# EAGLE design powerOutageLogger (EAGLE 9.6.2)
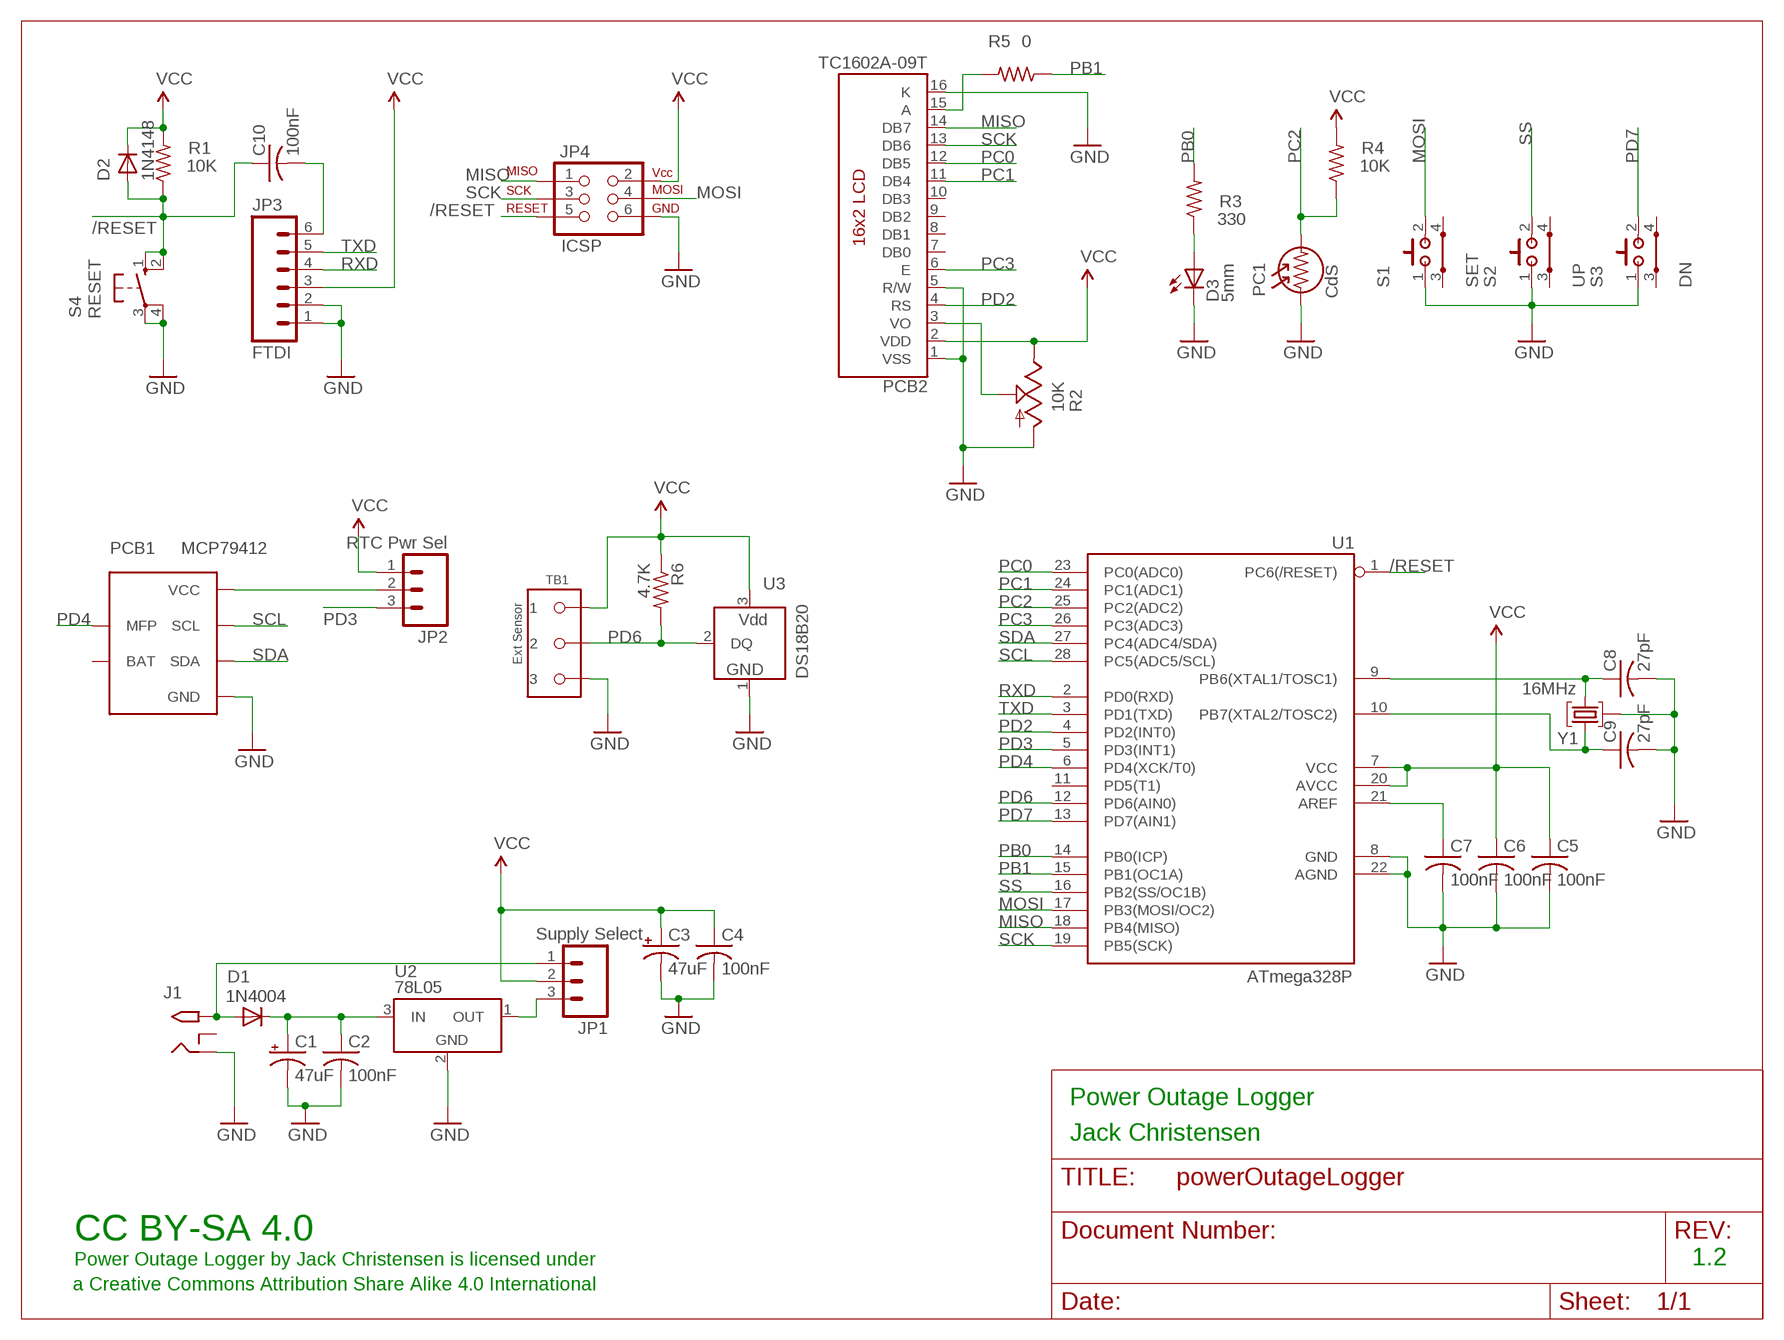
[diagram p0: schematic, sheet 1]

## Parts
C1  47uF  CPOL-USE2-5  [E2-5]
C2  100nF  C-US025-025X050  [C025-025X050]
C3  47uF  CPOL-USE2-5  [E2-5]
C4  100nF  C-US025-025X050  [C025-025X050]
C5  100nF  C-US025-025X050  [C025-025X050]
C6  100nF  C-US025-025X050  [C025-025X050]
C7  100nF  C-US025-025X050  [C025-025X050]
C8  27pF  C-US025-025X050  [C025-025X050]
C9  27pF  C-US025-025X050  [C025-025X050]
C10  100nF  C-US025-025X050  [C025-025X050]
D1  1N4004  DIODE1N400X  [1N400X]
D2  1N4148  DIODE1N4148  [1N4148]
D3  5mm  LED5MM  [LED5MM]
J1  2.1MMJACKTHM  [PJ-102A]
JP1  Supply Select  M03LOCK  [1X03_LOCK]
JP2  RTC Pwr Sel  M03LOCK  [1X03_LOCK]
JP3  FTDI  M06LOCK  [1X06_LOCK]
JP4  ICSP  AVR_SPI_PRG_6PTH  [2X3]
PC1  CdS  PHOTOCELL020-017  [PHOTOCELL-020-017]
PCB1  MCP79412  RTC79412  [RTC79412]
PCB2  TC1602A-09T  LCD-16X2  [LCD-16X2]
R1  10K  R-US_0204/6  [0204/6]
R2  10K  TRIMPOT-3386P3386P  [TRIMPOT-3386P]
R3  330  R-US_0204/6  [0204/6]
R4  10K  R-US_0204/6  [0204/6]
R5  0  R-US_0204/6  [0204/6]
R6  4.7K  R-US_0204/6  [0204/6]
S1  SET  B3F-312X  [B3F-312X]
S2  UP  B3F-312X  [B3F-312X]
S3  DN  B3F-312X  [B3F-312X]
S4  RESET  10-XXOCT  [B3F-10XXOCT]
TB1  Ext Sensor  OST-TB-33.5MM  [OST-TB-3-3.5MM]
U1  ATmega328P  AVR-MEGA8-PPTH  [DIL28-3]
U2  78L05  78XX-HTO92  [TO92-INLINE]
U3  DS18B20  [TO92-OVAL]
Y1  16MHz  RESONATOR  [RESONATOR]

## Nets
/RESET: C10.1 D2.A JP4.5 R1.1 S4.1(S) S4.2(S1) U1.1(PC6(/RESET))
GND: C1.- C2.2 C3.- C4.2 C5.2 C6.2 C7.2 C8.2 C9.2 D3.K(C) J1.RING JP3.1 JP3.2 JP4.6 PC1.P$1 PCB1.8(GND) PCB2.1(VSS) PCB2.5(R/W) PCB2.16(K) R2.3(A) S1.1 S2.1 S3.1 S4.3(P) S4.4(P1) TB1.P$3 U1.8(GND) U1.22(AGND) U2.2(GND) U3.1(GND) Y1.2
MISO: JP4.1 PCB2.14(DB7) U1.18(PB4(MISO))
MOSI: JP4.4 S1.2 U1.17(PB3(MOSI/OC2))
N$1: D1.A J1.TIP JP1.1
N$2: C1.+ C2.1 D1.K U2.3(IN)
N$3: PCB2.3(VO) R2.2(S)
N$4: D3.A R3.1
N$5: JP2.2 PCB1.7(VCC)
N$6: PCB2.15(A) R5.2
N$9: C7.1 U1.21(AREF)
OUT: JP1.3 U2.1(OUT)
PB0: R3.2 U1.14(PB0(ICP))
PB1: R5.1 U1.15(PB1(OC1A))
PC0: PCB2.12(DB5) U1.23(PC0(ADC0))
PC1: PCB2.11(DB4) U1.24(PC1(ADC1))
PC2: PC1.P$2 R4.1 U1.25(PC2(ADC2))
PC3: PCB2.6(E) U1.26(PC3(ADC3))
PD2: PCB2.4(RS) U1.4(PD2(INT0))
PD3: JP2.3 U1.5(PD3(INT1))
PD4: PCB1.3(MFP) U1.6(PD4(XCK/T0))
PD6: R6.2 TB1.P$2 U1.12(PD6(AIN0)) U3.2(DQ)
PD7: S3.2 U1.13(PD7(AIN1))
RST: C10.2 JP3.6
RXD: JP3.4 U1.2(PD0(RXD))
SCK: JP4.3 PCB2.13(DB6) U1.19(PB5(SCK))
SCL: PCB1.6(SCL) U1.28(PC5(ADC5/SCL))
SDA: PCB1.5(SDA) U1.27(PC4(ADC4/SDA))
SS: S2.2 U1.16(PB2(SS/OC1B))
TXD: JP3.5 U1.3(PD1(TXD))
VCC: C3.+ C4.1 C5.1 C6.1 D2.K JP1.2 JP2.1 JP3.3 JP4.2 PCB2.2(VDD) R1.2 R2.1(E) R4.2 R6.1 TB1.P$1 U1.7(VCC) U1.20(AVCC) U3.3(VDD)
XTAL1: C9.1 U1.10(PB7(XTAL2/TOSC2)) Y1.1
XTAL2: C8.1 U1.9(PB6(XTAL1/TOSC1)) Y1.3
Unconnected: J1.RING_SW PCB1.1(BAT) PCB2.7(DB0) PCB2.8(DB1) PCB2.9(DB2) PCB2.10(DB3) S1.3 S1.4 S2.3 S2.4 S3.3 S3.4 U1.11(PD5(T1))

## Notes on the sheet
- Power Outage Logger
- Jack Christensen
- CC BY-SA 4.0
- Power Outage Logger by Jack Christensen is licensed under | 1.2
- a Creative Commons Attribution Share Alike 4.0 International

## Library data of the parts
C1 C3 = _jc:CPOL-US: POLARIZED CAPACITOR, American symbol
C2 C4-C10 = _jc:C-US: CAPACITOR, American symbol
D1 D2 = _jc:DIODE
D3 = _jc:LED: LED OSRAM: - CHIPLED LG R971, LG N971, LY N971, LG Q971, LY Q971, LO R971, LY R971 LH N974, LH R974 LS Q976, LO Q976, LY Q976 LO Q996 - Hyper CHIPLED LW Q18S LB Q993, LB Q99A, LB R99A - SideLED LS A670, LO A670, LY A670, LG A670, LP A670 LB A673, LV A673, LT A673, LW A673 LH A674 LY A675 LS A676, LA A676, LO A676, LY A676, LW A676 LS A679, LY A679, LG A679 - Hyper Micro SIDELED® LS Y876, LA Y876, LO Y876, LY Y876 LT Y87S - SmartLED LW L88C, LW L88S LB L89C, LB L89S, LG L890 LS L89K, LO L89K, LY L89K LS L896, LA L896, LO L896, LY L896 - TOPLED LS T670, LO T670, LY T670, LG T670, LP T670 LSG T670, LSP T670, LSY T670, LOP T670, LYG T670 LG T671, LOG T671, LSG T671 LB T673, LV T673, LT T673, LW T673 LH T674 LS T676, LA T676, LO T676, LY T676, LB T676, LH T676, LSB T676, LW T676 LB T67C, LV T67C, LT T67C, LS T67K, LO T67K, LY T67K, LW E67C LS E67B, LA E67B, LO E67B, LY E67B, LB E67C, LV E67C, LT E67C LW T67C LS T679, LY T679, LG T679 LS T770, LO T770, LY T770, LG T770, LP T770 LB T773, LV T773, LT T773, LW T773 LH T774 LS E675, LA E675, LY E675, LS T675 LS T776, LA T776, LO T776, LY T776, LB T776 LHGB T686 LT T68C, LB T68C - Hyper Mini TOPLED® LB M676 - Mini TOPLED Santana® LG M470 LS M47K, LO M47K, LY M47K Source: http://www.osram.convergy.de/
J1 = adafruit:2.1MMJACK: 2.1mm x 5.5mm THM DC jack with internal switch. Digikey part #PJ-102A, 4UCON part #05537 2.1mm x 5.5mm SMT DC jack with internal switch. Digikey part #PJ-002A-SMT, 4UCON part #03267 By microbuilder.eu & adafruit.com
JP1 JP2 = SparkFun:M03: Header 3 Standard 3-pin 0.1" header. Use with straight break away headers (SKU : PRT-00116), right angle break away headers (PRT-00553), swiss pins (PRT-00743), machine pins (PRT-00117), and female headers (PRT-00115). Molex polarized connector foot print use with SKU : PRT-08232 with associated crimp pins and housings.
JP3 = SparkFun:M06: Header 6 Standard 6-pin 0.1" header. Use with straight break away headers (SKU : PRT-00116), right angle break away headers (PRT-00553), swiss pins (PRT-00743), machine pins (PRT-00117), and female headers (PRT-00115). Molex polarized connector foot print use with SKU : PRT-08094 with associated crimp pins and housings. NOTES ON THE VARIANTS LOCK and LOCK_LONGPADS... This footprint was designed to help hold the alignment of a through-hole component (i.e. 6-pin header) while soldering it into place. You may notice that each hole has been shifted either up or down by 0.005 of an inch from it's more standard position (which is a perfectly straight line). This slight alteration caused the pins (the squares in the middle) to touch the edges of the holes. Because they are alternating, it causes a "brace" to hold the component in place. 0.005 has proven to be the perfect amount of "off-center" position when using our standard breakaway headers. Although looks a little odd when you look at the bare footprint, once you have a header in there, the alteration is very hard to notice. Also, if you push a header all the way into place, it is covered up entirely on the bottom side. This idea of altering the position of holes to aid alignment will be further integrated into the Sparkfun Library for other footprints. It can help hold any component with 3 or more connection pins.
JP4 = _jc:AVR_SPI_PRG_6: AVR ISP 6 Pin This is the reduced ISP connector for AVR programming. Common on Arduino. This footprint will take up less PCB space and can be used with a 10-pin to 6-pin adapter such as SKU: BOB-08508
PC1 = _jc:PHOTOCELL
PCB1 = _jc:RTC79412
PCB2 = SparkFun:LCD-16X2
R1 R3-R6 = _jc:R-US_: RESISTOR, American symbol
R2 = _jc:TRIMPOT-3386P
S1-S3 = _jc:B3F-312X
S4 = _jc:10-XX: OMRON SWITCH
TB1 = _jc:OST-TB-3
U1 = SparkFun:AVR-MEGA8-P: MICROCONTROLLER 8 Kbytes FLASH 1 kbytes SRAM 512 bytes EEPROM USART 4-channel 10 bit ADC 2-channel 8 bit ADC
U2 = _jc:78XX-H
U3 = _jc:DS18B20
Y1 = _jc:RESONATOR: Ceramic resonator with capacitors or HC49/US crystal

## Board
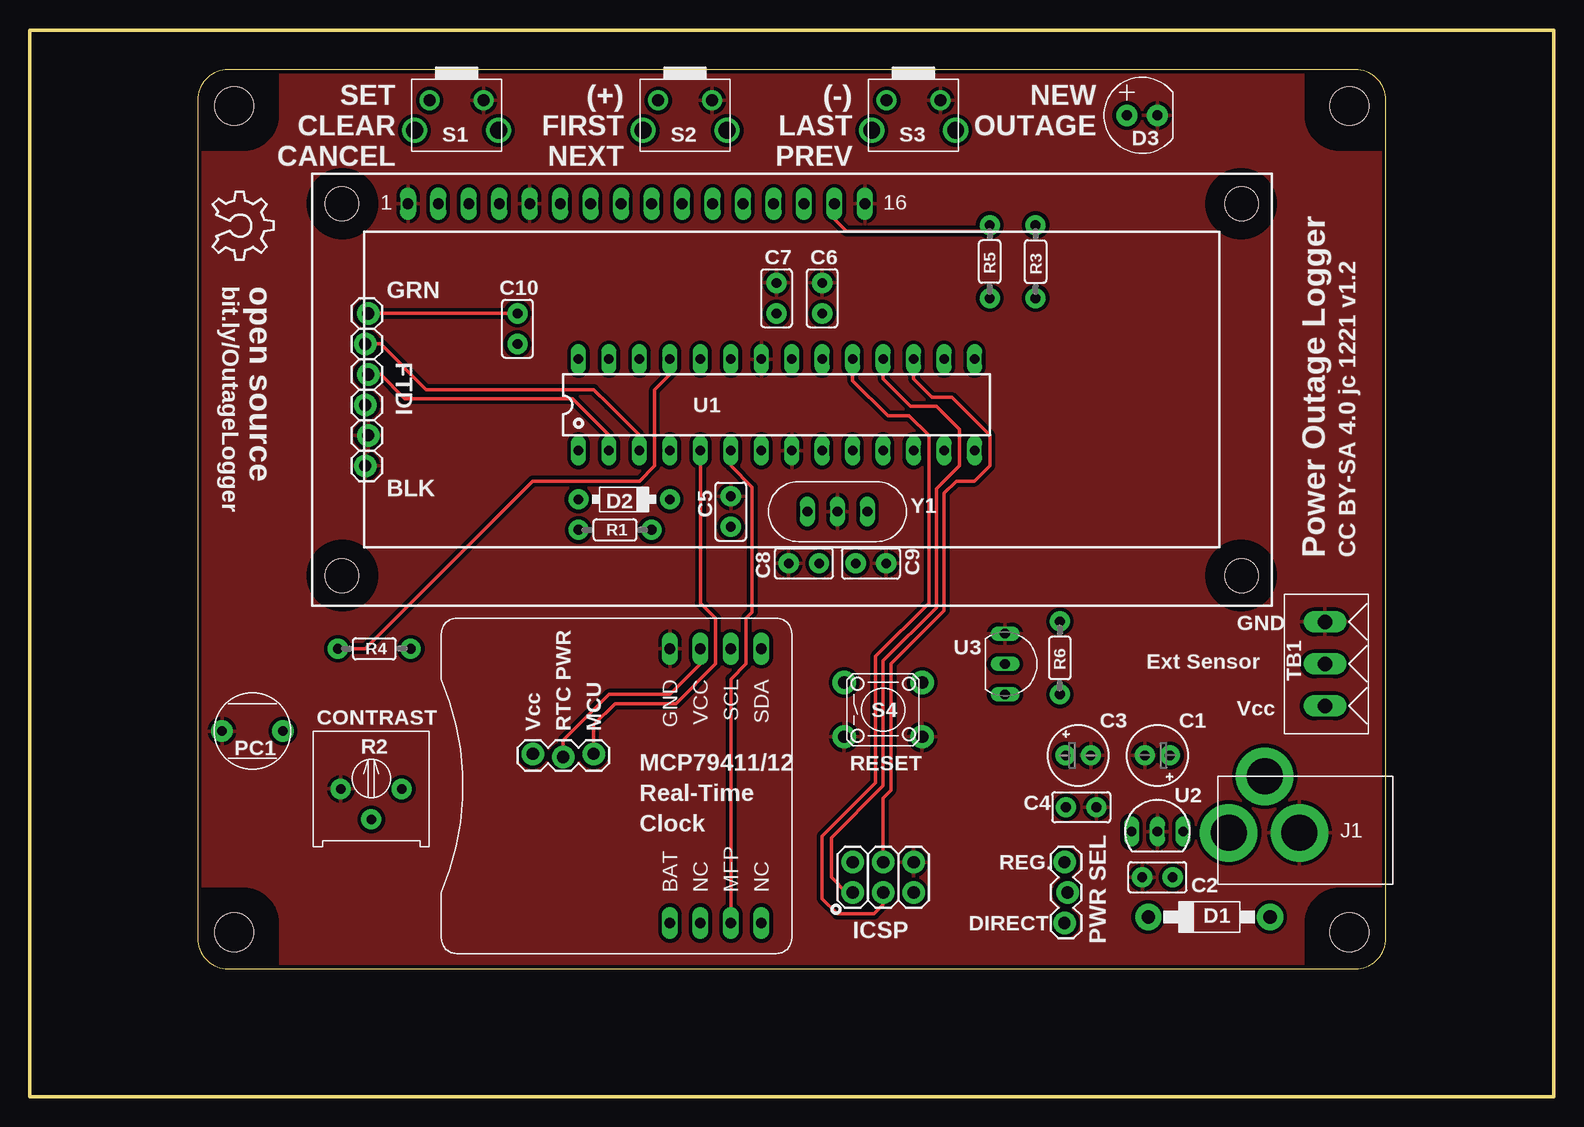
[diagram p1: board, top side]
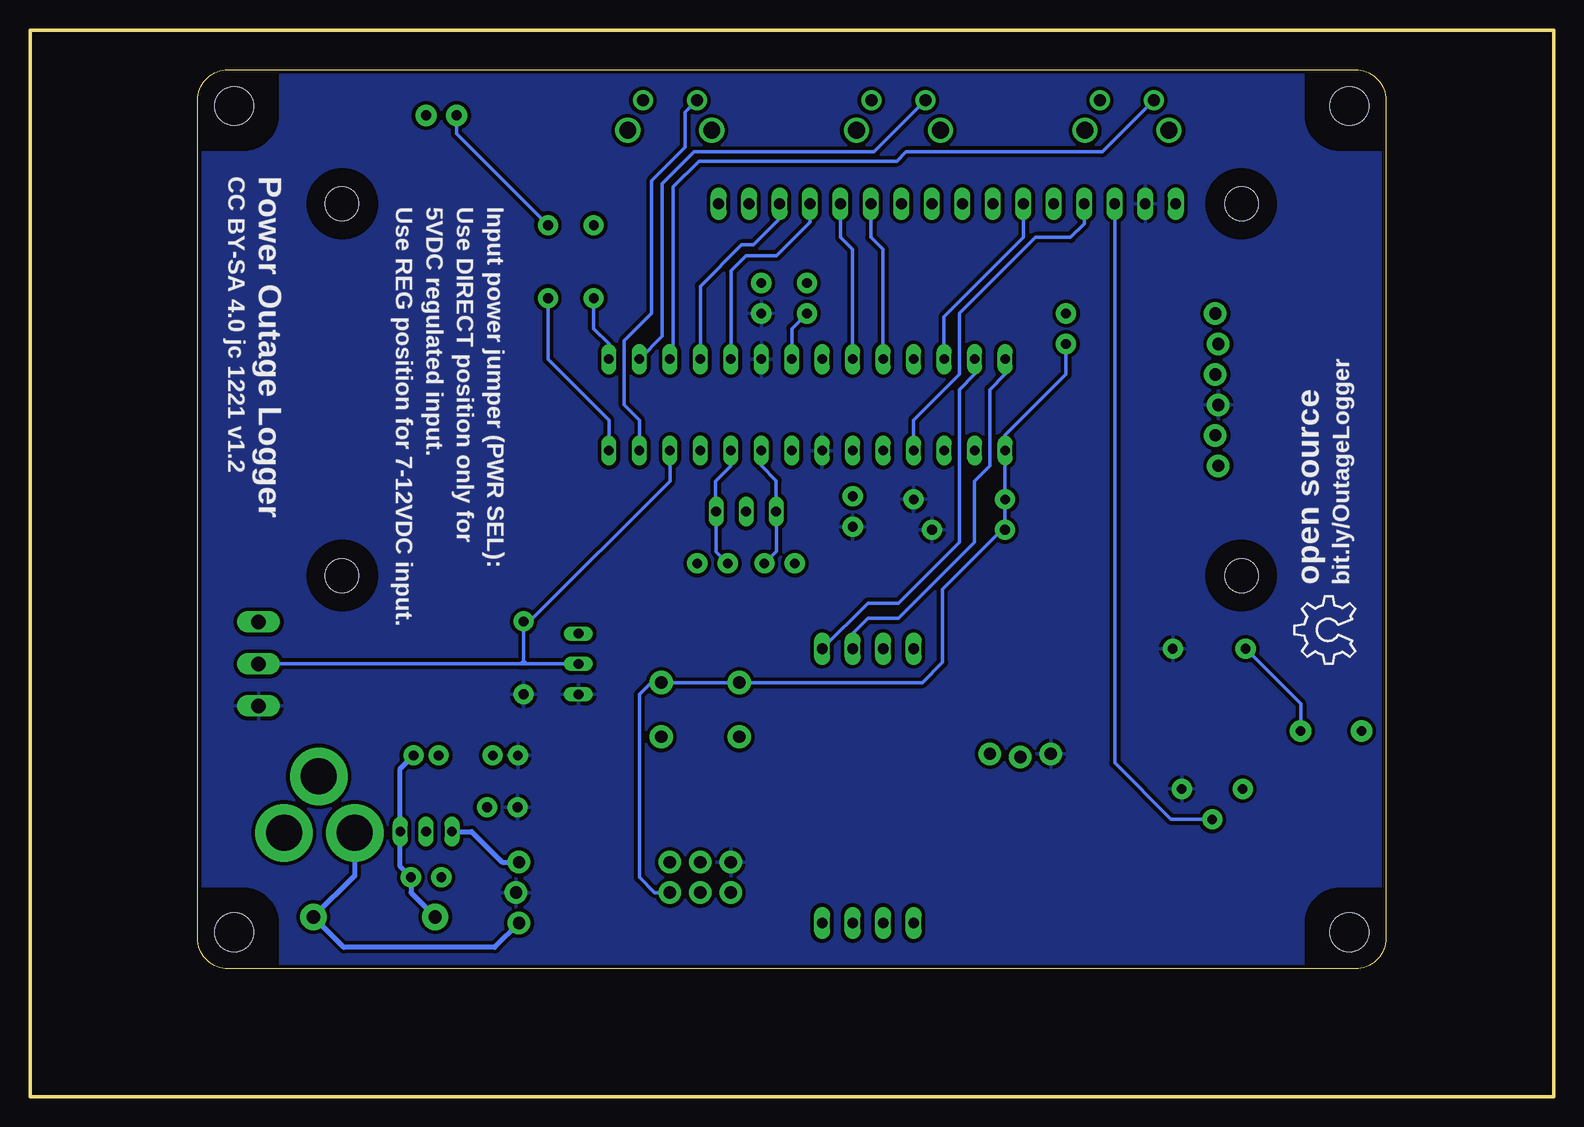
[diagram p2: board, bottom side, seen from below]

Size 127 x 88.9 mm. Coordinates in mm from the lower left corner, seen from the top.
Outline: 13.97,83.06 13.97,13.21 arc90 16.51,10.67 110.49,10.67 arc90 113.03,13.21 113.03,83.06 arc90 110.49,85.6 16.51,85.6 arc90 13.97,83.06
Outline: 0,88.9 127,88.9 127,0 0,0 0,88.9
Copper layers (1*16): Top 0.0356mm / dielectric 1.5011mm / Bottom 0.0356mm
Design rules "oshpark-2layer-jc": minimum track width 8mil, minimum drill 13mil, track to track 8mil, track to pad 8mil, pad to pad 8mil, via to via 8mil, smd to smd 6mil, copper to edge 12mil, drill to drill 6mil, minimum pad ring 7mil, minimum via ring 7mil, stop-mask expansion 2.5mil, vias tented up to drill 20mil, thermal gap 12mil
Holes 3.2 mm at 17.02,82.55 109.98,82.55 109.98,13.72 17.02,13.72
tRestrict: area 14,79.2 to 20.3,85.6; area 106.7,79.2 to 113,85.6; area 106.7,10.7 to 113,17; area 14,10.7 to 20.3,17; area 24,72.4 to 28.1,76.5; area 24,41.4 to 28.1,45.5; area 98.9,72.4 to 103,76.5; area 98.9,41.4 to 103,45.5
bRestrict: area 106.7,79.2 to 113,85.6; area 106.7,10.7 to 113,17; area 14,79.2 to 20.3,85.6; area 14,10.7 to 20.3,17; area 98.9,41.4 to 103,45.5; area 98.9,72.4 to 103,76.5; area 24,41.4 to 28.1,45.5; area 24,72.4 to 28.1,76.5

### Footprints (pad centres in the part's own frame; a part is rotated, then mirrored left to right if it is on the bottom)
E2-5 = drill 0.813 pad 1.676: + -1.05,0; - 1.05,0
C025-025X050 = drill 0.813 pad 1.676: 1 -1.27,0; 2 1.27,0
1N400X = drill 1.1 pad 2.184: A 5.08,0; K -5.08,0
1N4148 = drill 0.8 pad 1.676: A 3.81,0; K -3.81,0
LED5MM = drill 0.813 pad 1.778: A -1.27,0; K 1.27,0
PJ-102A = drill 3 pad 4.8: RING 0.1,-3.39; RING_SW -4.6,-6.29; TIP 0.1,-9.29
1X03_LOCK = drill 1.016 pad 1.88: 1 0,0.127; 2 2.54,-0.127; 3 5.08,0.127
1X06_LOCK = drill 1.016 pad 1.88: 1 0,0; 2 2.54,-0.254; 3 5.08,0; 4 7.62,-0.254; 5 10.16,0; 6 12.7,-0.254
2X3 = drill 1.016 pad 1.88: 1 0,0; 2 0,2.54; 3 2.54,0; 4 2.54,2.54; 5 5.08,0; 6 5.08,2.54
PHOTOCELL-020-017 = drill 0.8 pad 1.778: P$1 -2.54,0; P$2 2.54,0
RTC79412 = drill 0.9 long: 1 -11.43,-3.81; 2 -11.43,-6.35; 3 -11.43,-8.89; 4 -11.43,-11.43; 5 11.43,-11.43; 6 11.43,-8.89; 7 11.43,-6.35; 8 11.43,-3.81
LCD-16X2 = drill 0.9 long: 1 -32,15.5; 2 -29.46,15.5; 3 -26.92,15.5; 4 -24.38,15.5; 5 -21.84,15.5; 6 -19.3,15.5; 7 -16.76,15.5; 8 -14.22,15.5; 9 -11.68,15.5; 10 -9.14,15.5; 11 -6.6,15.5; 12 -4.06,15.5; 13 -1.52,15.5; 14 1.02,15.5; 15 3.56,15.5; 16 6.1,15.5 | hole 2.8: -37.5,15.5; -37.5,-15.5; 37.5,15.5; 37.5,-15.5
0204/6 = drill 0.813 pad 1.676: 1 -3.04,0; 2 3.04,0
TRIMPOT-3386P = drill 0.8 pad 1.676: 1 2.54,0; 2 0,-2.54; 3 -2.54,0
B3F-312X = drill 1 pad 1.676: 1 2.25,1.25; 2 -2.25,1.25 | drill 1.4: 3 3.5,-1.25; 4 -3.5,-1.25
B3F-10XXOCT = drill 1.016 pad 1.93: 1 -3.251,2.261; 2 3.251,2.261; 3 -3.251,-2.261; 4 3.251,-2.261
OST-TB-3-3.5MM = drill 1.2 long: P$1 -3.5,0; P$2 0,0; P$3 3.5,0
DIL28-3 = drill 0.8 pad 1.27 long: 1 -16.51,-3.81; 2 -13.97,-3.81; 3 -11.43,-3.81; 4 -8.89,-3.81; 5 -6.35,-3.81; 6 -3.81,-3.81; 7 -1.27,-3.81; 8 1.27,-3.81; 9 3.81,-3.81; 10 6.35,-3.81; 11 8.89,-3.81; 12 11.43,-3.81; 13 13.97,-3.81; 14 16.51,-3.81; 15 16.51,3.81; 16 13.97,3.81; 17 11.43,3.81; 18 8.89,3.81; 19 6.35,3.81; 20 3.81,3.81; 21 1.27,3.81; 22 -1.27,3.81; 23 -3.81,3.81; 24 -6.35,3.81; 25 -8.89,3.81; 26 -11.43,3.81; 27 -13.97,3.81; 28 -16.51,3.81
TO92-INLINE = drill 0.8 pad 1.27 long: 1 -2.159,0; 2 0,0; 3 2.159,0
TO92-OVAL = drill 0.813 long: 1 -2.54,0; 2 0,0; 3 2.54,0
RESONATOR = drill 0.8 pad 1.27 long: 1 -2.5,0; 2 0,0; 3 2.5,0

### Placement (x,y rotation side)
C1  93.98,28.45 180 top
C2  93.98,18.29 180 top
C3  87.38,28.45 0 top
C4  87.63,24.13 0 top
C5  58.42,48.77 90 top
C6  66.04,66.55 90 top
C7  62.23,66.55 90 top
C8  64.52,44.45 180 top
C9  70.1,44.45 0 top
C10  40.64,64.01 90 top
D1  98.3,14.99 0 top
D2  49.53,49.78 180 top
D3  92.71,81.79 0 top
J1  109.22,22.1 270 top
JP1  86.36,14.48 90 top
JP2  41.91,28.45 0 top
JP3  27.94,52.58 90 top
JP4  68.58,17.02 0 top
PC1  18.54,30.48 0 top
PCB1  49.53,25.91 90 top
PCB2  63.5,58.93 0 top
R1  48.77,47.24 0 top
R2  28.45,25.65 0 top
R3  83.82,69.6 270 top
R4  28.7,37.34 0 top
R5  80.01,69.6 90 top
R6  85.85,36.58 90 top
S1  35.56,81.79 0 top
S2  54.61,81.79 0 top
S3  73.66,81.79 0 top
S4  71.12,32.26 0 top
TB1  107.95,36.07 90 top
U1  62.23,57.66 0 top
U2  93.98,22.1 0 top
U3  81.28,36.07 270 top
U$1  [OSHW_8X200_NOTEXT]  15.24,75.44 270 top
U$2  [OSHW_8X200_NOTEXT]  16.51,36.07 90 bottom
Y1  67.31,48.77 180 top

### Tracks (layer width: path | path; a pad name or v marks a point on that pad's centre or on a via)
/RESET
  Bottom 0.305: JP4.5 74.93,17.02 76.2,18.29 76.2,33.53 75.21,34.52 S4.2 S4.1 52.6,34.52 50.93,36.2 50.93,42.29 45.97,47.25 R1.1 | C10.1 40.64,60.2 45.72,55.12 U1.1 D2.A R1.1 | R1.1
GND
  pour Top (isolate 0.305): 11.43,88.14 115.57,88.14 115.57,8.13 11.43,8.13
MISO
  Top 0.305: U1.18 71.12,59.82 73.41,57.53 75.56,57.53 77.47,55.63 77.47,52.58 75.56,50.67 75.56,40.77 71.12,36.32 71.12,25.91 66.8,21.59 66.8,18.29 68.07,17.02 JP4.1
  Bottom 0.305: PCB2.14 64.52,73.15 66.67,70.99 67.69,70.99 71.12,67.56 U1.18
MOSI
  Top 0.305: U1.17 73.66,59.82 75.18,58.29 76.84,58.29 80.01,55.12 80.01,52.58 78.74,51.31 77.22,51.31 76.2,50.29 76.2,40.51 71.75,36.07 71.75,25.53 71.12,24.89 JP4.4
  Bottom 0.305: U1.17 73.41,61.72 73.41,75.82 71.25,77.98 54.74,77.98 53.98,78.74 37.61,78.74 S1.2
N$1
  Bottom 0.406: J1.TIP 99.93,18.43 D1.A 100.84,12.45 88.27,12.45 JP1.1
N$2
  Bottom 0.406: C1.+ 96.14,27.34 U2.3 96.14,19.18 C2.1 95.25,17.02 D1.K
N$3
  Bottom 0.305: R2.2 31.88,23.11 36.58,27.82 PCB2.3
N$4
  Bottom 0.305: R3.1 91.44,80.26 D3.A
N$5
  Top 0.305: PCB1.7 55.88,36.07 53.34,33.53 48.26,33.53 44.45,29.72 JP2.2
N$6
  Top 0.305: R5.2 79.51,72.14 68.07,72.14 67.06,73.15 PCB2.15
N$9
  Bottom 0.305: C7.1 63.5,64.01 U1.21
OUT
  Bottom 0.406: U2.1 90.17,22.1 87.63,19.56 JP1.3
PB0
  Bottom 0.305: U1.14 78.74,56.39 83.82,61.47 R3.2
PB1
  Bottom 0.305: U1.15 78.74,62.74 80.01,64.01 R5.1
PC0
  Bottom 0.305: PCB2.12 59.44,71.63 58.42,70.61 58.42,70.36 U1.23
PC1
  Bottom 0.305: PCB2.11 56.9,71.63 55.88,70.61 U1.24
PC2
  Top 0.305: R4.1 27.94,37.34 41.91,51.31 50.8,51.31 52.07,52.58 52.07,58.93 53.34,60.2 U1.25
  Bottom 0.305: R4.1 21.08,32.76 PC1.P$2
PC3
  Bottom 0.305: PCB2.6 44.2,71.63 50.8,65.02 U1.26
PD2
  Bottom 0.305: U1.4 53.34,56.39 49.53,60.2 49.53,65.28 43.18,71.63 40.26,71.63 39.12,72.77 PCB2.4
PD3
  Top 0.305: JP2.3 46.99,30.99 48.77,32.77 53.85,32.77 57.15,36.07 57.15,39.88 55.88,41.15 U1.5
PD4
  Top 0.305: U1.6 58.42,52.58 60.2,50.8 60.2,40.39 59.69,39.88 59.69,36.07 58.42,34.8 PCB1.3
PD6
  Bottom 0.305: U3.2 85.6,36.07 | 85.6,36.07 85.85,36.07 | 85.85,36.07 86.11,36.07 | 86.11,36.07 TB1.P$2 | U1.12 73.66,52.58 73.66,51.31 85.35,39.62 R6.2 85.85,36.32 | 85.85,36.32 85.85,36.07 | 85.6,36.07 85.85,36.32 | 85.85,36.32 86.11,36.07
PD7
  Bottom 0.305: U1.13 76.2,56.39 77.47,57.66 77.47,62.99 75.18,65.28 75.18,76.33 72.39,79.12 72.39,82.06 S3.2
RST
  Top 0.305: JP3.6 C10.2
RXD
  Top 0.305: U1.2 48.26,55.12 45.21,58.17 31.24,58.17 29.21,60.2 JP3.4
SCK
  Top 0.305: U1.19 68.58,59.69 71.5,56.77 73.28,56.77 74.93,55.12 74.93,41.15 70.48,36.7 70.48,26.16 66.04,21.72 66.04,16.51 67.31,15.24 70.36,15.24 71.12,16 JP4.3
  Bottom 0.305: PCB2.13 61.98,72.9 64.77,70.1 67.31,70.1 68.58,68.83 U1.19
SCL
  Bottom 0.305: U1.28 45.72,60.2 46.99,58.93 46.99,52.58 48.26,51.31 48.26,46.23 54.61,39.88 57.15,39.88 58.42,38.61 PCB1.6
SDA
  Bottom 0.305: U1.27 48.26,60.2 49.53,58.93 49.53,46.23 54.61,41.15 57.15,41.15 PCB1.5
SS
  Bottom 0.305: S2.2 56.66,78.74 71.63,78.74 74.3,76.07 74.3,63.37 U1.16
TXD
  Top 0.305: U1.3 50.8,55.12 48.26,57.66 46.99,58.93 33.02,58.93 29.21,62.74 JP3.5
VCC
  pour Bottom (isolate 0.305): 12.7,86.87 114.3,86.87 114.3,9.4 12.7,9.4
XTAL1
  Bottom 0.305: U1.10 68.58,52.58 69.85,51.31 69.85,48.81 Y1.1 69.81,45.43 C9.1
XTAL2
  Bottom 0.305: U1.9 66.04,52.58 64.81,51.35 Y1.3 64.81,47.54 64.77,47.5 64.77,45.47 C8.1

### Text on the board
tPlace: SET | (+) | (-) | NEW | CLEAR | FIRST | LAST | OUTAGE | CANCEL | NEXT | PREV | bit.ly/OutageLogger | open source | GRN | FTDI | BLK | Power Outage Logger | CC BY-SA 4.0 jc 1221 v1.2 | GND | Vcc | CONTRAST | Vcc | RTC PWR | MCU | MCP79411/12 | RESET | Real-Time | Clock | PWR SEL | REG. | ICSP | DIRECT
bPlace: Power Outage Logger | CC BY-SA 4.0 jc 1221 v1.2 | Input power jumper (PWR SEL): | Use DIRECT position only for | 5VDC regulated input. | Use REG position for 7-12VDC input. | bit.ly/OutageLogger | open source